# EAGLE design thinManV2 (EAGLE 6.6.0)

## Sheet 1 of 4
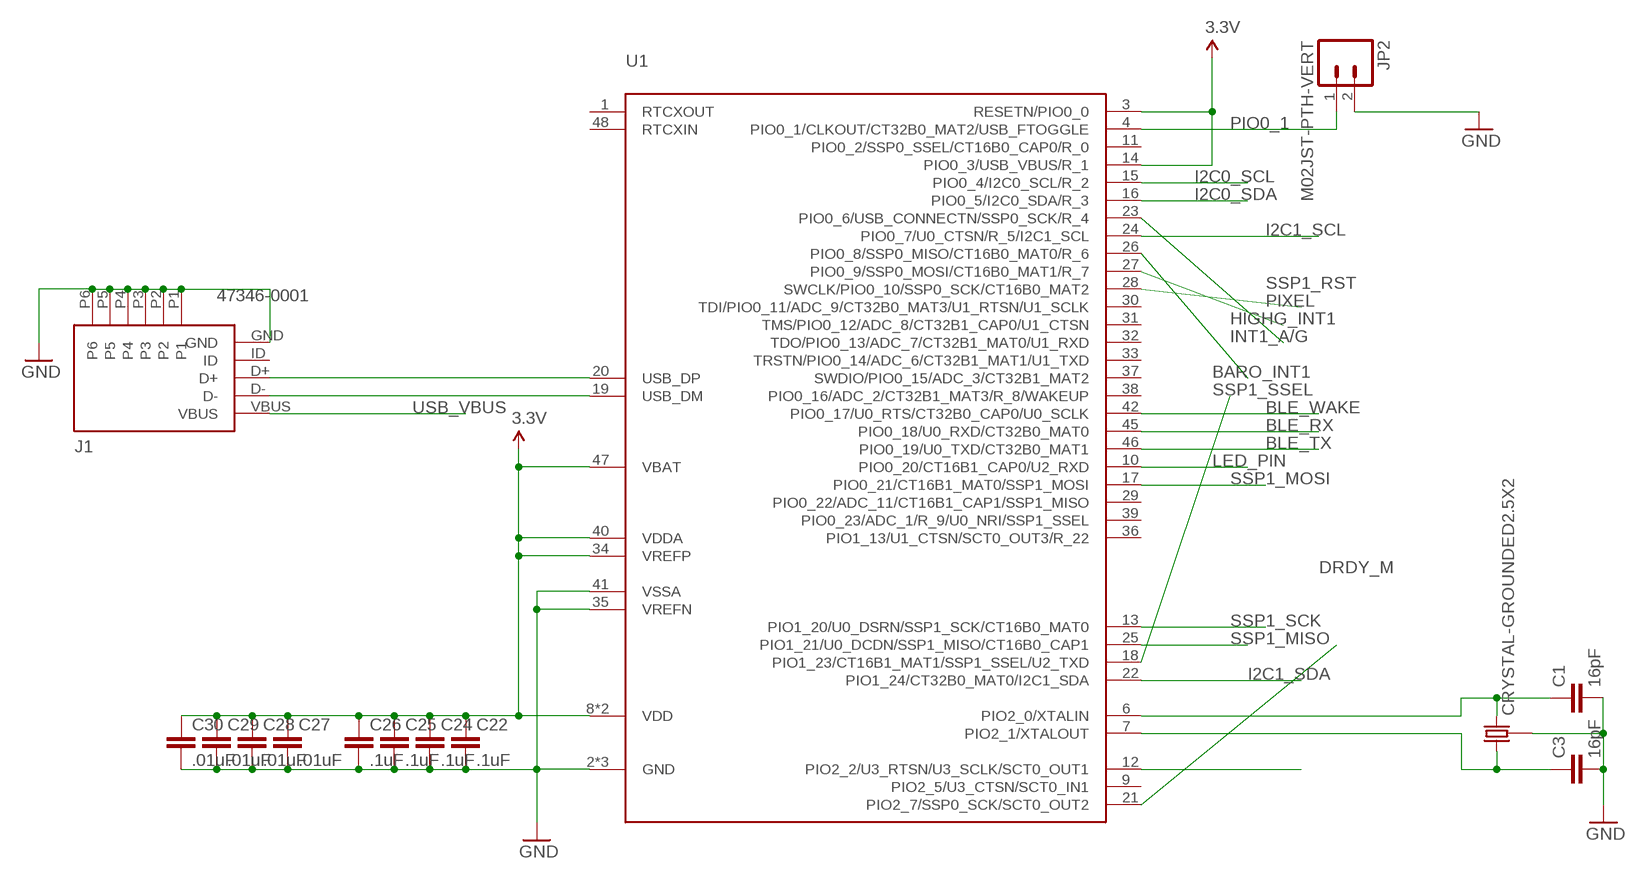
[diagram p0: schematic, sheet 1]

### Parts
C1  16pF  C0603  [C0603]
C3  16pF  C0603  [C0603]
C22  .1uF  C0603  [C0603]
C24  .1uF  C0603  [C0603]
C25  .1uF  C0603  [C0603]
C26  .1uF  C0603  [C0603]
C27  .01uF  C0603  [C0603]
C28  .01uF  C0603  [C0603]
C29  .01uF  C0603  [C0603]
C30  .01uF  C0603  [C0603]
J1  47346-0001  MICRO-USB  [MICRO_USB]
JP2  M02JST-PTH-VERT  [JST-2-PTH-VERT]
U1  LPC11U68JBD48  [LQFP48]
U$5  CRYSTAL-GROUNDED2.5X2  [CRYSTAL-SMD-2.5X2]

### Nets
3.3V: C22.1 C24.1 C25.1 C26.1 C27.1 C28.1 C29.1 C30.1 U1.3(RESETN/PIO0_0) U1.8(VDD) U1.14(PIO0_3/USB_VBUS/R_1) U1.34(VREFP) U1.40(VDDA) U1.44(VDD) U1.47(VBAT) ; also sheet 2,3,4
BARO_INT1: U1.26(PIO0_8/SSP0_MISO/CT16B0_MAT0/R_6) ; also sheet 2
BLE_RX: U1.45(PIO0_18/U0_RXD/CT32B0_MAT0) ; also sheet 3
BLE_TX: U1.46(PIO0_19/U0_TXD/CT32B0_MAT1) ; also sheet 3
BLE_WAKE: U1.42(PIO0_17/U0_RTS/CT32B0_CAP0/U0_SCLK) ; also sheet 3
DRDY_M: U1.21(PIO2_7/SSP0_SCK/SCT0_OUT2) ; also sheet 2
GND: C1.2 C3.2 C22.2 C24.2 C25.2 C26.2 C27.2 C28.2 C29.2 C30.2 J1.GND J1.P1 J1.P2 J1.P3 J1.P4 J1.P5 J1.P6 JP2.2 U1.2(GND) U1.5(GND) U1.35(VREFN) U1.41(VSSA) U1.43(GND) U$5.GND1 U$5.GND2 ; also sheet 2,3,4
HIGHG_INT1: U1.27(PIO0_9/SSP0_MOSI/CT16B0_MAT1/R_7) ; also sheet 2
I2C0_SCL: U1.15(PIO0_4/I2C0_SCL/R_2) ; also sheet 2
I2C0_SDA: U1.16(PIO0_5/I2C0_SDA/R_3) ; also sheet 2
I2C1_SCL: U1.24(PIO0_7/U0_CTSN/R_5/I2C1_SCL) ; also sheet 2,3
I2C1_SDA: U1.22(PIO1_24/CT32B0_MAT0/I2C1_SDA) ; also sheet 2,3
INT1_A/G: U1.23(PIO0_6/USB_CONNECTN/SSP0_SCK/R_4) ; also sheet 2
LED_PIN: U1.10(PIO0_20/CT16B1_CAP0/U2_RXD) ; also sheet 3
N$2: C3.1 U1.7(PIO2_1/XTALOUT) U$5.P1
N$3: C1.1 U1.6(PIO2_0/XTALIN) U$5.P2
N$15: J1.D+ U1.20(USB_DP)
N$17: J1.D- U1.19(USB_DM)
PIO0_1: JP2.1 U1.4(PIO0_1/CLKOUT/CT32B0_MAT2/USB_FTOGGLE)
PIXEL: U1.28(SWCLK/PIO0_10/SSP0_SCK/CT16B0_MAT2) ; also sheet 3
SSP1_MISO: U1.25(PIO1_21/U0_DCDN/SSP1_MISO/CT16B0_CAP1) ; also sheet 3
SSP1_MOSI: U1.17(PIO0_21/CT16B1_MAT0/SSP1_MOSI) ; also sheet 3
SSP1_RST: U1.12(PIO2_2/U3_RTSN/U3_SCLK/SCT0_OUT1) ; also sheet 3
SSP1_SCK: U1.13(PIO1_20/U0_DSRN/SSP1_SCK/CT16B0_MAT0) ; also sheet 3
SSP1_SSEL: U1.18(PIO1_23/CT16B1_MAT1/SSP1_SSEL/U2_TXD) ; also sheet 3
USB_VBUS: J1.VBUS ; also sheet 4
Unconnected: J1.ID U1.1(RTCXOUT) U1.9(PIO2_5/U3_CTSN/SCT0_IN1) U1.11(PIO0_2/SSP0_SSEL/CT16B0_CAP0/R_0) U1.29(PIO0_22/ADC_11/CT16B1_CAP1/SSP1_MISO) U1.30(TDI/PIO0_11/ADC_9/CT32B0_MAT3/U1_RTSN/U1_SCLK) U1.31(TMS/PIO0_12/ADC_8/CT32B1_CAP0/U1_CTSN) U1.32(TDO/PIO0_13/ADC_7/CT32B1_MAT0/U1_RXD) U1.33(TRSTN/PIO0_14/ADC_6/CT32B1_MAT1/U1_TXD) U1.36(PIO1_13/U1_CTSN/SCT0_OUT3/R_22) U1.37(SWDIO/PIO0_15/ADC_3/CT32B1_MAT2) U1.38(PIO0_16/ADC_2/CT32B1_MAT3/R_8/WAKEUP) U1.39(PIO0_23/ADC_1/R_9/U0_NRI/SSP1_SSEL) U1.48(RTCXIN)

## Sheet 2 of 4
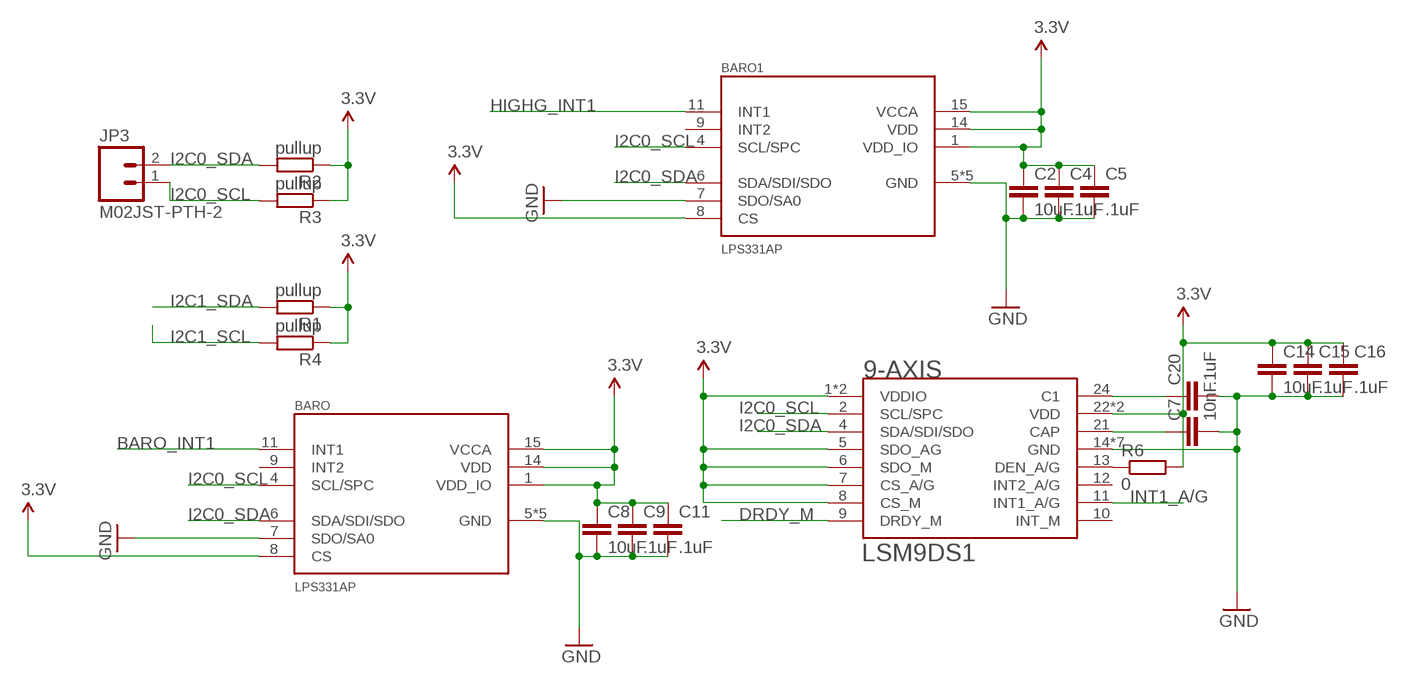
[diagram p1: schematic, sheet 2]

### Parts
9-AXIS  LSM9DS1  [LGA-24L-3.5X3X1]
BARO  LPS331AP  [LGA-16-3X3X1]
BARO1  LPS331AP  [LGA-16-3X3X1]
C2  10uF  C0603  [C0603]
C4  .1uF  C0603  [C0603]
C5  .1uF  C0603  [C0603]
C7  10nF  C0603  [C0603]
C8  10uF  C0603  [C0603]
C9  .1uF  C0603  [C0603]
C11  .1uF  C0603  [C0603]
C14  10uF  C0603  [C0603]
C15  .1uF  C0603  [C0603]
C16  .1uF  C0603  [C0603]
C20  .1uF  C0603  [C0603]
JP3  M02JST-PTH-2  [JST-2-PTH]
R1  pullup  R0805  [R0805]
R2  pullup  R0603  [R0603]
R3  pullup  R0603  [R0603]
R4  pullup  R0805  [R0805]
R6  0  R0603  [R0603]

### Nets
3.3V: 9-AXIS.1(VDDIO) 9-AXIS.3(VDDIO) 9-AXIS.5(SDO_AG) 9-AXIS.6(SDO_M) 9-AXIS.7(CS_A/G) 9-AXIS.8(CS_M) 9-AXIS.22(VDD) 9-AXIS.23(VDD) BARO1.1(VDD_IO) BARO1.8(CS) BARO1.14(VDD) BARO1.15(VCCA) BARO.1(VDD_IO) BARO.8(CS) BARO.14(VDD) BARO.15(VCCA) C2.1 C4.1 C5.1 C8.1 C9.1 C11.1 C14.1 C15.1 C16.1 R1.1 R2.1 R3.1 R4.1 R6.2 ; also sheet 1,3,4
BARO_INT1: BARO.11(INT1) ; also sheet 1
DRDY_M: 9-AXIS.9(DRDY_M) ; also sheet 1
GND: 9-AXIS.14(GND) 9-AXIS.15(GND) 9-AXIS.16(GND) 9-AXIS.17(GND) 9-AXIS.18(GND) 9-AXIS.19(GND) 9-AXIS.20(GND) BARO1.5(GND) BARO1.7(SDO/SA0) BARO1.10(GND) BARO1.12(GND) BARO1.13(GND) BARO1.16(GND) BARO.5(GND) BARO.7(SDO/SA0) BARO.10(GND) BARO.12(GND) BARO.13(GND) BARO.16(GND) C2.2 C4.2 C5.2 C7.2 C8.2 C9.2 C11.2 C14.2 C15.2 C16.2 C20.2 ; also sheet 1,3,4
HIGHG_INT1: BARO1.11(INT1) ; also sheet 1
I2C0_SCL: 9-AXIS.2(SCL/SPC) BARO1.4(SCL/SPC) BARO.4(SCL/SPC) JP3.1 R3.2 ; also sheet 1
I2C0_SDA: 9-AXIS.4(SDA/SDI/SDO) BARO1.6(SDA/SDI/SDO) BARO.6(SDA/SDI/SDO) JP3.2 R2.2 ; also sheet 1
I2C1_SCL: R4.2 ; also sheet 1,3
I2C1_SDA: R1.2 ; also sheet 1,3
INT1_A/G: 9-AXIS.11(INT1_A/G) ; also sheet 1
N$1: 9-AXIS.13(DEN_A/G) R6.1
N$11: 9-AXIS.21(CAP) C7.1
N$14: 9-AXIS.24(C1) C20.1
Unconnected: 9-AXIS.10(INT_M) 9-AXIS.12(INT2_A/G) BARO1.9(INT2) BARO.9(INT2)

## Sheet 3 of 4
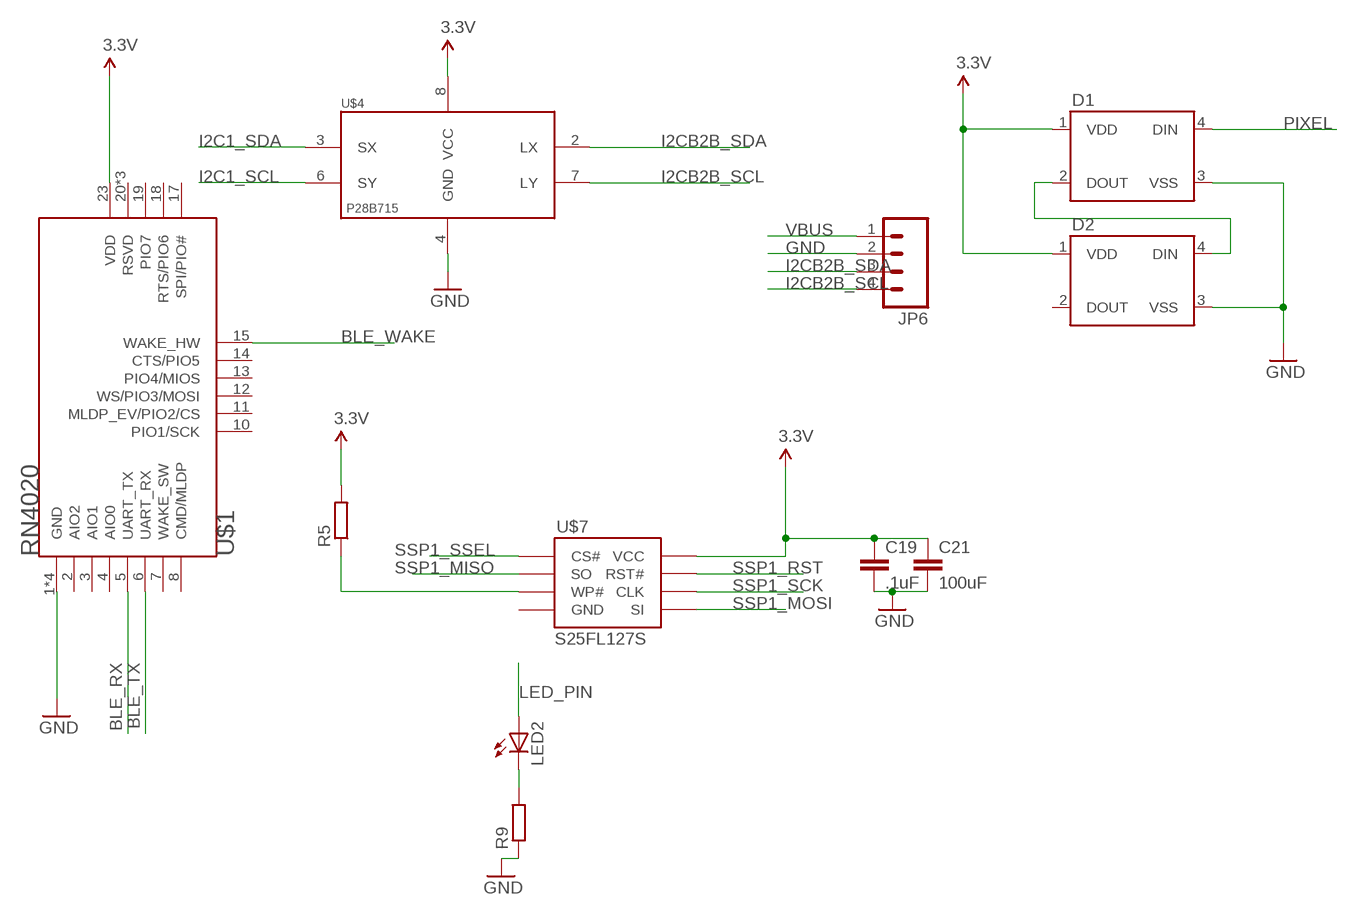
[diagram p2: schematic, sheet 3]

### Parts
C19  .1uF  C0603  [C0603]
C21  100uF  C0603  [C0603]
D1  WS2812B  [WS2812B]
D2  WS2812B  [WS2812B]
JP6  M04JST  [1X04-1.5MM_JST]
LED2  LEDCHIPLED_0603  [CHIPLED_0603]
R5  R0603  [R0603]
R9  R0603  [R0603]
U$1  RN4020  [RN4020]
U$4  P82B715  [SO8]
U$7  S25FL127S  [SO08]

### Nets
3.3V: C19.1 C21.1 D1.1(VDD) D2.1(VDD) R5.2 U$1.23(VDD) U$4.8(VCC) U$7.8(VCC) ; also sheet 1,2,4
BLE_RX: U$1.5(UART_TX) ; also sheet 1
BLE_TX: U$1.6(UART_RX) ; also sheet 1
BLE_WAKE: U$1.15(WAKE_HW) ; also sheet 1
GND: C19.2 C21.2 D1.3(VSS) D2.3(VSS) JP6.2 R9.1 U$1.1(GND) U$1.9(GND) U$1.16(GND) U$1.24(GND) U$4.4(GND) ; also sheet 1,2,4
I2C1_SCL: U$4.6(SY) ; also sheet 1,2
I2C1_SDA: U$4.3(SX) ; also sheet 1,2
I2CB2B_SCL: JP6.4 U$4.7(LY)
I2CB2B_SDA: JP6.3 U$4.2(LX)
LED_PIN: LED2.A ; also sheet 1
N$4: R5.1 U$7.3(WP#)
N$5: LED2.C R9.2
N$6: D1.2(DOUT) D2.4(DIN)
PIXEL: D1.4(DIN) ; also sheet 1
SSP1_MISO: U$7.2(SO) ; also sheet 1
SSP1_MOSI: U$7.5(SI) ; also sheet 1
SSP1_RST: U$7.7(RST#) ; also sheet 1
SSP1_SCK: U$7.6(CLK) ; also sheet 1
SSP1_SSEL: U$7.1(CS#) ; also sheet 1
VBUS: JP6.1 ; also sheet 4
Unconnected: D2.2(DOUT) U$1.2(AIO2) U$1.3(AIO1) U$1.4(AIO0) U$1.7(WAKE_SW) U$1.8(CMD/MLDP) U$1.10(PIO1/SCK) U$1.11(MLDP_EV/PIO2/CS) U$1.12(WS/PIO3/MOSI) U$1.13(PIO4/MIOS) U$1.14(CTS/PIO5) U$1.17(SPI/PIO#) U$1.18(RTS/PIO6) U$1.19(PIO7) U$1.20(RSVD) U$1.21(RSVD) U$1.22(RSVD) U$7.4(GND)

## Sheet 4 of 4: Power
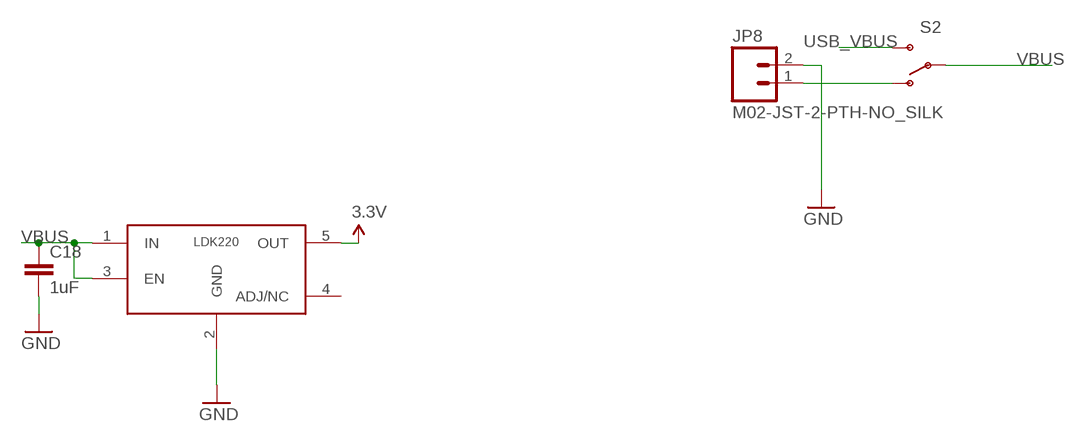
[diagram p3: schematic, sheet 4]

### Parts
C18  1uF  C0603  [C0603]
JP8  M02-JST-2-PTH-NO_SILK  [JST-2-PTH-NS]
S2  SWITCH-SPDT-SMD-A  [SWITCH-SPST-SMD-A]
U$6  LDK220M33R  [SOT23-5]

### Nets
3.3V: U$6.5(OUT) ; also sheet 1,2,3
GND: C18.2 JP8.2 U$6.2(GND) ; also sheet 1,2,3
N$20: JP8.1 S2.1(O)
USB_VBUS: S2.3(S) ; also sheet 1
VBUS: C18.1 S2.2(P) U$6.1(IN) U$6.3(EN) ; also sheet 3
Unconnected: U$6.4(ADJ/NC)

## Library data of the parts
9-AXIS = Sensors:LSM9DS1; OC_NEWARK: unknown
BARO BARO1 = Sensors:LPS331AP; MPN: LPS331APTR; OC_NEWARK: 52X6707
C1 C3 = ELL-i-Passives:C: Surface Mount Capasitors — in standard sizes A capacitor used to store energy electrostatically in an electric field. If you need a high-value capacitor, consider using a polarised capacitor to save space. Wikipedia article on capacitors <https://en.wikipedia.org/wiki/Capacitor>; OC_NEWARK: unknown
C2 C4 C5 C8 C9 C11 C14-C16 C18 C19 C21 C22 C24-C30 = ELL-i-Passives:C: Surface Mount Capasitors — in standard sizes A capacitor used to store energy electrostatically in an electric field. If you need a high-value capacitor, consider using a polarised capacitor to save space. Wikipedia article on capacitors <https://en.wikipedia.org/wiki/Capacitor>
C7 C20 = ELL-i-Passives:C: Surface Mount Capasitors — in standard sizes A capacitor used to store energy electrostatically in an electric field. If you need a high-value capacitor, consider using a polarised capacitor to save space. Wikipedia article on capacitors <https://en.wikipedia.org/wiki/Capacitor>; MPN: S103M47Z5UN63L0R; OC_NEWARK: 83K9283
D1 D2 = SparkFun-LED:WS2812B: WS2812B - Intelligent control LED integrated light source Technical Specifications: Power Supply Voltage (VDD): 3.5 to 5.3 V Input Voltage (VI): -0.5 to VDD+0.5 V Operating Junction Temperature (Topt): -25°C to +80°C Storage Temperature Range (Tstg): -55°C to +150°C
J1 = ELL-i-Connectors:MICRO-USB: Micro USB from Molex CONN RCPT 5POS MICRO USB R/A Datasheet <http://www.molex.com/pdm_docs/sd/473460001_sd.pdf>; PARTNO: AS-ITM-00021
JP2 = SparkFun-Connectors:M02: Standard 2-pin 0.1" header. Use with - straight break away headers ( PRT-00116) - right angle break away headers (PRT-00553) - swiss pins (PRT-00743) - machine pins (PRT-00117) - female headers (PRT-00115) Molex polarized connector foot print use with: PRT-08233 with associated crimp pins and housings. 2.54_SCREWTERM for use with PRT-10571. 3.5mm Screw Terminal footprints for PRT-08084 5mm Screw Terminal footprints for use with PRT-08432
JP3 = SparkFun-Connectors:M02: Standard 2-pin 0.1" header. Use with - straight break away headers ( PRT-00116) - right angle break away headers (PRT-00553) - swiss pins (PRT-00743) - machine pins (PRT-00117) - female headers (PRT-00115) Molex polarized connector foot print use with: PRT-08233 with associated crimp pins and housings. 2.54_SCREWTERM for use with PRT-10571. 3.5mm Screw Terminal footprints for PRT-08084 5mm Screw Terminal footprints for use with PRT-08432; OC_NEWARK: unknown; SKU: PRT-09914
JP6 = SparkFun-Connectors:M04: Header 4 Standard 4-pin 0.1" header. Use with straight break away headers (SKU : PRT-00116), right angle break away headers (PRT-00553), swiss pins (PRT-00743), machine pins (PRT-00117), and female headers (PRT-00115). Molex polarized connector foot print use with SKU : PRT-08231 with associated crimp pins and housings. 1MM SMD Version SKU: PRT-10208; OC_NEWARK: unknown
JP8 = SparkFun-Connectors:M02: Standard 2-pin 0.1" header. Use with - straight break away headers ( PRT-00116) - right angle break away headers (PRT-00553) - swiss pins (PRT-00743) - machine pins (PRT-00117) - female headers (PRT-00115) Molex polarized connector foot print use with: PRT-08233 with associated crimp pins and housings. 2.54_SCREWTERM for use with PRT-10571. 3.5mm Screw Terminal footprints for PRT-08084 5mm Screw Terminal footprints for use with PRT-08432; OC_NEWARK: unknown
LED2 = adafruit:LED: LED OSRAM: - CHIPLED LG R971, LG N971, LY N971, LG Q971, LY Q971, LO R971, LY R971 LH N974, LH R974 LS Q976, LO Q976, LY Q976 LO Q996 - Hyper CHIPLED LW Q18S LB Q993, LB Q99A, LB R99A - SideLED LS A670, LO A670, LY A670, LG A670, LP A670 LB A673, LV A673, LT A673, LW A673 LH A674 LY A675 LS A676, LA A676, LO A676, LY A676, LW A676 LS A679, LY A679, LG A679 - Hyper Micro SIDELED® LS Y876, LA Y876, LO Y876, LY Y876 LT Y87S - SmartLED LW L88C, LW L88S LB L89C, LB L89S, LG L890 LS L89K, LO L89K, LY L89K LS L896, LA L896, LO L896, LY L896 - TOPLED LS T670, LO T670, LY T670, LG T670, LP T670 LSG T670, LSP T670, LSY T670, LOP T670, LYG T670 LG T671, LOG T671, LSG T671 LB T673, LV T673, LT T673, LW T673 LH T674 LS T676, LA T676, LO T676, LY T676, LB T676, LH T676, LSB T676, LW T676 LB T67C, LV T67C, LT T67C, LS T67K, LO T67K, LY T67K, LW E67C LS E67B, LA E67B, LO E67B, LY E67B, LB E67C, LV E67C, LT E67C LW T67C LS T679, LY T679, LG T679 LS T770, LO T770, LY T770, LG T770, LP T770 LB T773, LV T773, LT T773, LW T773 LH T774 LS E675, LA E675, LY E675, LS T675 LS T776, LA T776, LO T776, LY T776, LB T776 LHGB T686 LT T68C, LB T68C - Hyper Mini TOPLED® LB M676 - Mini TOPLED Santana® LG M470 LS M47K, LO M47K, LY M47K Source: http://www.osram.convergy.de/; OC_NEWARK: unknown
R1-R4 R9 = ELL-i-Passives:R: Surface Mount Resistor — in standard sizes; OC_NEWARK: unknown
R5 R6 = ELL-i-Passives:R: Surface Mount Resistor — in standard sizes
S2 = SparkFun-Electromechanical:SWITCH-SPDT: SPDT Switch Simple slide switch, Spark Fun Electronics SKU : COM-00102 DPDT SMT slide switch, AYZ0202, SWCH-08179
U1 = LPC11U68:LPC11U68JBD48; OC_NEWARK: unknown
U$1 = bluetooth:RN4020: RN4020 Bluetooth Low Energy RF module
U$4 = Sensors:P82B715; OC_NEWARK: unknown
U$5 = SparkFun-FreqCtrl:CRYSTAL-GROUNDED; OC_NEWARK: unknown
U$6 = Sensors:LDK220M33R; OC_NEWARK: unknown
U$7 = SparkFun-DigitalIC:S25FL127S

## Board
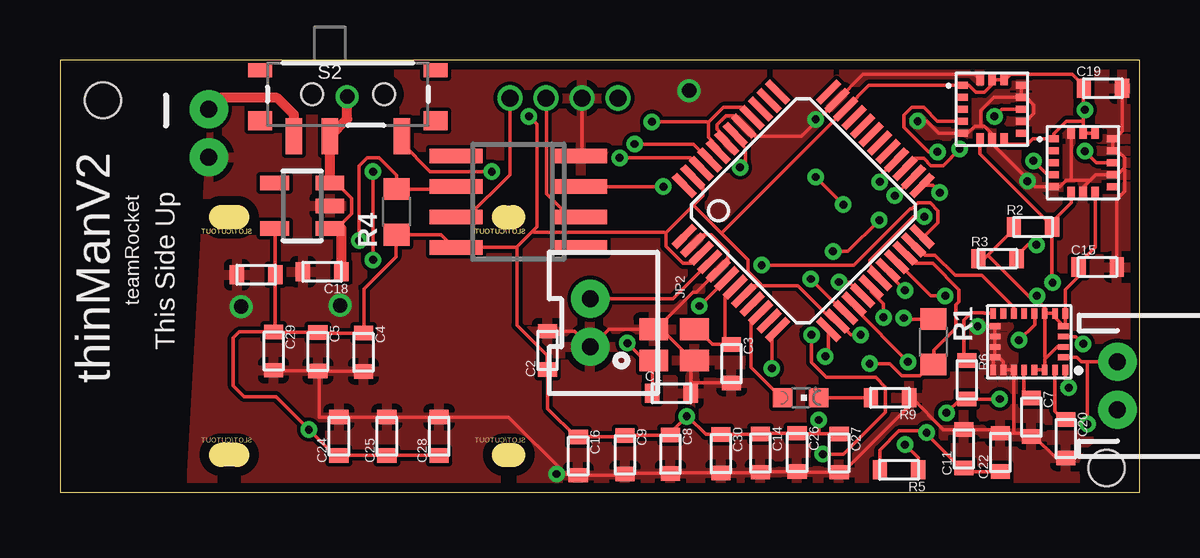
[diagram p4: board, top side]
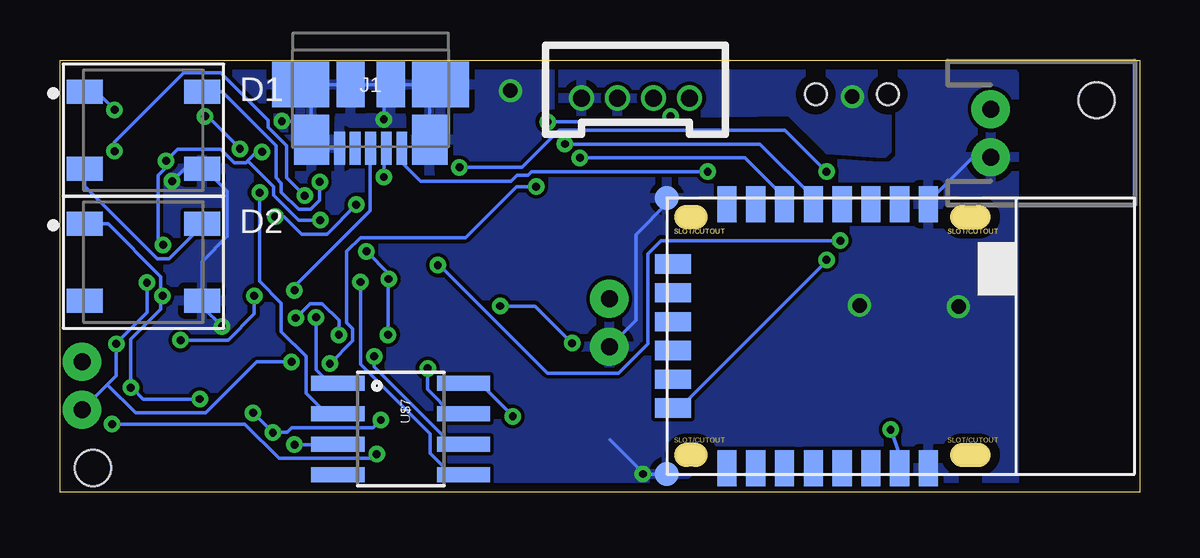
[diagram p5: board, bottom side, seen from below]

Size 45 x 18 mm. Coordinates in mm from the lower left corner, seen from the top.
Outline: 0,0 45,0 45,18 0,18 0,0
Copper layers (1*16): Top 0.0356mm / dielectric 1.5011mm / Bottom 0.0356mm
Design rules "LaenPCBOrder *": minimum track width 6mil, minimum drill 13mil, track to track 6mil, track to pad 6mil, pad to pad 6mil, via to via 6mil, smd to smd 6mil, copper to edge 15mil, drill to drill 6mil, minimum pad ring 7mil, minimum via ring 7mil, stop-mask expansion 3mil, vias tented up to drill 0mil, thermal gap 10mil
Holes 1.5 mm at 43.62,1 1.8,16.32

### Footprints (pad centres in the part's own frame; a part is rotated, then mirrored left to right if it is on the bottom)
LGA-24L-3.5X3X1 = smd 0.24 x 0.45: 1 0.245,2.675; 6 0.245,0.325; 7 0.675,0.325; 8 1.105,0.325; 9 1.535,0.325; 10 1.965,0.325; 11 2.395,0.325; 12 2.825,0.325; 13 3.255,0.325; 18 3.255,2.675; 19 2.825,2.675; 20 2.395,2.675; 21 1.965,2.675; 22 1.535,2.675; 23 1.105,2.675; 24 0.675,2.675 | smd 0.45 x 0.24: 2 0.325,2.145; 3 0.325,1.715; 4 0.325,1.285; 5 0.325,0.855; 14 3.175,0.855; 15 3.175,1.285; 16 3.175,1.715; 17 3.175,2.145
LGA-16-3X3X1 = smd 0.45 x 0.3: 1 0.275,2.5; 2 0.275,2; 3 0.275,1.5; 4 0.275,1; 5 0.275,0.5; 9 2.725,0.5; 10 2.725,1; 11 2.725,1.5; 12 2.725,2; 13 2.725,2.5 | smd 0.3 x 0.45: 6 1,0.275; 7 1.5,0.275; 8 2,0.275; 14 2,2.725; 15 1.5,2.725; 16 1,2.725
C0603 = smd 0.6 x 0.8: 1 -0.8,0; 2 0.8,0
WS2812B = smd 1.5 x 1: 1 -2.45,1.6; 2 -2.45,-1.6; 3 2.45,-1.6; 4 2.45,1.6
MICRO_USB = smd 1.38 x 0.45: D+ 2.66,0; D- 2.66,0.65; GND 2.66,-1.3; ID 2.66,-0.65; VBUS 2.66,1.3 | smd 2.1 x 1.475: P1 2.3,-2.462; P2 2.3,2.462 | smd 1.9 x 2.375: P3 0,2.913; P4 0,-2.913 | smd 1.9 x 1.175: P5 0,0.838; P6 0,-0.838
JST-2-PTH-VERT = drill 0.7 pad 1.6: 1 -1,-0.55; 2 1,-0.55
JST-2-PTH = drill 0.7 pad 1.6: 1 -1,0; 2 1,0
1X04-1.5MM_JST = drill 0.7: 1 0,0; 2 1.5,0; 3 3,0; 4 4.5,0
JST-2-PTH-NS = drill 0.7 pad 1.6: 1 -1,0; 2 1,0
CHIPLED_0603 = smd 0.8 x 0.8: A 0,-0.75; C 0,0.75
R0805 = smd 0.9 x 1.1: 1 -0.95,0; 2 0.95,0
R0603 = smd 0.6 x 0.8: 1 -0.8,0; 2 0.8,0
SWITCH-SPST-SMD-A = smd 0.7 x 1.5: 1 -2.25,-1.75; 2 -0.75,-1.75; 3 2.25,-1.75 | smd 1 x 0.6: GND1 -3.65,1; GND3 3.65,1 | smd 1 x 0.8: GND2 -3.65,-1.1; GND4 3.65,-1.1 | hole 0.9: -1.5,0; 1.5,0
LQFP48 = smd 0.3 x 1.2: 1 -2.75,-4.25; 2 -2.25,-4.25; 3 -1.75,-4.25; 4 -1.25,-4.25; 5 -0.75,-4.25; 6 -0.25,-4.25; 7 0.25,-4.25; 8 0.75,-4.25; 9 1.25,-4.25; 10 1.75,-4.25; 11 2.25,-4.25; 12 2.75,-4.25; 25 2.75,4.25; 26 2.25,4.25; 27 1.75,4.25; 28 1.25,4.25; 29 0.75,4.25; 30 0.25,4.25; 31 -0.25,4.25; 32 -0.75,4.25; 33 -1.25,4.25; 34 -1.75,4.25; 35 -2.25,4.25; 36 -2.75,4.25 | smd 1.2 x 0.3: 13 4.25,-2.75; 14 4.25,-2.25; 15 4.25,-1.75; 16 4.25,-1.25; 17 4.25,-0.75; 18 4.25,-0.25; 19 4.25,0.25; 20 4.25,0.75; 21 4.25,1.25; 22 4.25,1.75; 23 4.25,2.25; 24 4.25,2.75; 37 -4.25,2.75; 38 -4.25,2.25; 39 -4.25,1.75; 40 -4.25,1.25; 41 -4.25,0.75; 42 -4.25,0.25; 43 -4.25,-0.25; 44 -4.25,-0.75; 45 -4.25,-1.25; 46 -4.25,-1.75; 47 -4.25,-2.25; 48 -4.25,-2.75
RN4020 = smd 1.5 x 0.8: 1 0.25,10.9; 2 0.25,9.7; 3 0.25,8.5; 4 0.25,7.3; 5 0.25,6.1; 6 0.25,4.9; 7 0.25,3.7; 8 0.25,2.5; 17 11.25,2.5; 18 11.25,3.7; 19 11.25,4.9; 20 11.25,6.1; 21 11.25,7.3; 22 11.25,8.5; 23 11.25,9.7; 24 11.25,10.9 | smd 1 x 1: 9 0,0; 16 11.5,0 | smd 0.8 x 1.5: 10 2.75,0.25; 11 3.95,0.25; 12 5.15,0.25; 13 6.35,0.25; 14 7.55,0.25; 15 8.75,0.25
SO8 = smd 0.6 x 2.2: 1 -1.905,-2.6; 2 -0.635,-2.6; 3 0.635,-2.6; 4 1.905,-2.6; 5 1.905,2.6; 6 0.635,2.6; 7 -0.635,2.6; 8 -1.905,2.6
CRYSTAL-SMD-2.5X2 = smd 1.2 x 0.9: GND1 0.6,1.8; GND2 2.3,0.5; P1 2.3,1.8; P2 0.6,0.5
SOT23-5 = smd 0.6 x 1.2: 1 -0.95,-1.15; 2 0,-1.15; 3 0.95,-1.15; 4 0.95,1.15; 5 -0.95,1.15
SO08 = smd 0.61 x 2.21: 1 -1.905,-2.616; 2 -0.635,-2.616; 3 0.635,-2.616; 4 1.905,-2.616; 5 1.905,2.616; 6 0.635,2.616; 7 -0.635,2.616; 8 -1.905,2.616

### Placement (x,y rotation side)
9-AXIS  42.15,7.76 180 top
BARO  41.15,12.22 0 top
BARO1  37.35,14.45 0 top
C1  25.49,4.12 0 top
C2  20.32,5.9 90 top
C3  28,5.35 270 top
C4  12.65,5.83 270 top
C5  10.75,5.85 270 top
C7  40.49,3.12 270 top
C8  25.45,1.57 270 top
C9  23.55,1.55 270 top
C11  37.67,1.8 90 top
C14  29.2,1.62 270 top
C15  43.25,9.38 0 top
C16  21.6,1.5 270 top
C18  10.93,9.18 180 top
C19  43.48,16.82 0 top
C20  41.92,2.23 270 top
C21  8.18,9.05 180 top
C22  39.2,1.65 90 top
C24  11.62,2.33 90 top
C25  13.62,2.33 90 top
C26  30.73,1.65 270 top
C27  32.48,1.62 270 top
C28  15.8,2.33 90 top
C29  8.9,5.88 270 top
C30  27.55,1.6 270 top
D1  41.52,15.07 0 bottom
D2  41.52,9.57 0 bottom
J1  32.05,16.98 270 bottom
JP2  22.65,7.05 270 top
JP3  44.08,4.42 270 top
JP6  23.26,16.41 0 bottom
JP8  6.2,14.95 270 bottom
LED2  30.88,3.92 270 top
R1  36.41,6.25 270 top
R2  40.56,11.04 0 top
R3  39.08,9.72 0 top
R4  14.03,11.67 90 top
R5  34.98,0.93 180 top
R6  37.8,4.67 270 top
R9  34.6,3.93 180 top
S2  12,16.57 0 top
U1  30.98,11.71 315 top
U$1  19.7,12.25 270 bottom
U$4  19.11,12.1 90 top
U$5  24.15,4.98 0 top
U$6  10.1,11.93 90 top
U$7  30.8,2.62 270 bottom

### Tracks (layer width: path | path; a pad name or v marks a point on that pad's centre or on a via)
3.3V  (via drill 0.33)
  Top 0.152: BARO1.8 39.35,14.62 39.48,14.5 40.33,14.5 40.55,14.72 41.4,14.72 BARO.1 41.42,14.8 41.42,14.93 41.95,15.45 42.65,15.45 | BARO.14 43.12,14.95 BARO.15 42.65,15.03 42.65,15.45 | 42.65,15.93 42.65,16.77 42.67,16.8 C19.1 42.7,16.9 42.2,17.4 39.62,17.4 39.42,17.2 BARO1.14 BARO1.15 38.85,16.98 38.52,16.65 38.17,16.65 37.88,16.95 BARO1.1 33.73,16.95 32.75,15.97 U1.34 32.7,15.9 27.57,10.78 | 42.65,15.93 42.65,15.45 | v42.73,15.93 42.65,15.93 | 25.25,10.8 25.25,10.25 25.98,9.53 26.32,9.53 26.73,9.93 U1.3 | 26.4,11.95 26.8,12.35 26.8,12.75 26.4,13.15 U1.47 | 26.4,11.95 25.25,10.8 | v35.17,7.25 35.23,7.2 R1.1 | v33.38,6.55 32.98,6.55 U1.14 32.35,7.17 32.17,7.17 30.75,8.6 29.2,8.6 | 29.2,8.6 28.93,8.6 28.52,8.2 U1.8 | 27.57,10.78 28.68,9.68 28.68,9.2 29.2,8.68 29.2,8.6 | 27.57,10.78 26.4,11.95 | R3.1 38.52,9.72 38.67,9.88 | 38.67,9.88 39.75,10.95 39.75,11.03 R2.1 | 9-AXIS.8 41.05,7.45 41.4,7.45 9-AXIS.7 41.48,7.28 41.83,6.92 9-AXIS.5 41.9,6.95 9-AXIS.6 41.9,7.5 41.9,8.43 42.45,8.97 C15.1 42.45,9.5 43.15,10.2 43.15,12.47 BARO.8 | 9-AXIS.22 40.62,5.1 41.02,5.1 9-AXIS.23 41.05,5.17 41.05,5.53 41.1,5.58 | 41.1,5.58 41.58,6.05 9-AXIS.3 | 9-AXIS.8 41.05,7.38 41.05,5.62 41.1,5.58 | 38.67,9.88 40.6,7.95 40.73,7.95 | 40.73,7.95 40.77,7.95 41.05,7.67 41.05,7.53 9-AXIS.8 | R5.2 34.17,1.75 34.98,2.55 36,2.55 36.1,2.45 | 36.1,2.45 37.55,1 C11.1 37.8,1 37.95,0.85 C22.1 | v42.05,4.35 41.9,4.5 9-AXIS.1 | v39.17,3.88 R6.2 37.52,3.88 v36.95,3.3 | v36.12,2.48 36.1,2.45 | v40.73,8.18 40.73,7.95 | C28.1 C25.1 C24.1 11.45,1.52 v10.38,2.6 9,3.98 7.67,3.98 7.22,4.42 7.22,6.42 7.47,6.67 C29.1 | U$6.5 8.97,10.97 C21.1 8.97,6.72 C29.1
  Top 0.152: C5.1 8.95,6.65 8.93,6.67 C29.1 | C5.1 10.82,6.62 C4.1 12.68,6.7 12.68,8.47 14,9.8 14,10.65 R4.1 14.05,10.72 15.88,10.72 16.4,10.2 U$4.8 16.57,10.2 19.02,10.2 | 10.72,6.58 C5.1 | 31.62,2.42 30.8,2.42 C26.1 29.27,2.45 C14.1 29.18,2.42 29.15,2.4 C30.1 26.93,2.4 26.2,3.12 v26.12,3.15 25.43,2.45 C8.1 23.62,2.38 C9.1 23.43,2.35 23.38,2.3 C16.1 21.52,2.27 20.32,3.48 C2.1 20.3,5.17 20.3,5.7 19.05,6.95 19.05,10.12 19.02,10.2 | 31.62,2.42 C27.1 | 27.02,15.4 27.02,14.78 27.43,14.38 27.43,14.2 U1.44 | 27.02,15.4 27.65,16.02 28.43,16.02 U1.40 | v24.68,15.43 26.95,15.43 27.02,15.4 | v19.55,15.65 19.88,15.32 19.88,11.05 19.7,10.88 | 19.02,10.2 19.7,10.88 | 31.62,2.42 v31.62,3 | 25.25,10.8 25.18,10.82 19.75,10.82 19.7,10.88
  Bottom 0.152: D1.1 43.48,16.68 v42.73,15.93 | v35.17,7.25 34.58,7.85 34.08,7.85 33.38,7.15 v33.38,6.55 | 40.8,8.18 40.8,8.97 43,11.18 D2.1 | 40.8,8.18 40.8,7.62 42.05,6.38 v42.05,4.35 41.98,4.33 41.52,3.88 v39.17,3.88 | v36.95,3.3 v36.12,2.48 36.05,2.5 35.52,2.5 35.35,2.67 31.95,2.67 v31.62,3 | v40.73,8.18 40.8,8.18 | U$1.23 10,1.52 v10.38,2.6 | v26.12,3.15 27.5,4.53 U$7.8 | v24.68,15.43 19.77,15.43 v19.55,15.65
BARO_INT1  (via drill 0.33)
  Top 0.152: v42.73,14.2 43.2,13.72 43.85,13.72 BARO.11 | v34.8,12.35 U1.26
  Bottom 0.152: v42.73,14.2 42.73,14.6 39.85,17.48 38.3,17.48 36.33,15.5 36.33,15.2 35.55,14.43 35.55,13.1 v34.8,12.35
BLE_RX  (via drill 0.33)
  Top 0.152: v23.95,14.5 26.4,14.5 27.05,13.85 27.07,13.85 U1.45
  Bottom 0.152: v23.95,14.5 15.82,14.5 13.6,12.28 U$1.5
BLE_TX  (via drill 0.33)
  Top 0.152: v23.32,13.93 26.27,13.93 26.7,13.5 26.73,13.5 U1.46
  Bottom 0.152: v23.32,13.93 16.45,13.93 14.8,12.28 U$1.6
BLE_WAKE  (via drill 0.33)
  Top 0.152: v28.35,13.53 28.57,13.75 28.57,14.32 28.18,14.72 28.18,14.88 U1.42 | v13.05,9.68 v13.05,13.35
  Bottom 0.152: v28.35,13.53 25.75,13.53 24.2,15.07 14.78,15.07 v13.05,13.35 | v13.05,9.68 13.05,9.62 19.18,3.5 U$1.15
DRDY_M  (via drill 0.33)
  Top 0.152: v39.98,6.33 40.62,6.97 9-AXIS.9 | v36.9,8.18 36.3,8.18 U1.21
  Bottom 0.152: v39.98,6.33 38,6.33 36.9,7.42 v36.9,8.18
GND  (via drill 0.33, 0.6)
  Top 0.152: U1.43 27.77,14.55 27.77,14.72 27.38,15.12 27.38,15.3 27.75,15.68 28.07,15.68 U1.41 28.57,15.22 28.98,14.82 30.9,14.82 31.55,15.47 | BARO1.16 38.12,17.4 33.48,17.4 32.4,16.32 U1.35 32.35,16.27 31.55,15.47 | U$4.4 21.75,14 JP6.2 | v31.5,15.53 31.55,15.47 | U1.2 26.4,10.32 26.8,10.72 27.15,10.72 27.85,10.03 27.85,9.65 U1.5 27.4,9.2 26.52,8.32 26.38,8.32 24.9,6.85 U$5.GND1 | 26.3,4.55 26.3,5.42 26.35,5.47 U$5.GND2 26.32,5.53 25.07,6.78 U$5.GND1 | 26.3,4.55 C1.2 | 26.3,4.55 C3.2 | C2.2 21.45,6.7 JP2.2 | U$5.GND1 24.68,6.78 22.88,6.78 22.18,6.08 JP2.2 | 38.38,15.25 38.12,15.25 37.83,14.95 BARO1.5 36.62,14.95 36.12,15.45 v35.75,15.45 | 38.38,15.25 38.52,15.25 38.85,14.93 BARO1.7 38.85,14.53 40.38,13 | BARO1.10 40.27,15.45 40.6,15.78 40.6,16.12 40.27,16.45 BARO1.12 | BARO1.12 BARO1.13 | 38.38,15.25 38.38,15.9 38.92,16.45 BARO1.12 | 42.9,12.95 43.17,13.22 43.85,13.22 BARO.10 43.92,13.22 44.08,13.22 44.33,13.47 | 42.9,12.95 42.65,12.7 BARO.7 | 42.15,13 42.85,13 42.9,12.95 | 42.15,13 41.95,13 41.67,12.72 BARO.5 41.35,12.72 40.65,12.72 40.38,13 | 42.15,13 42.15,14.93 BARO.16 | 44.33,13.47 44.38,13.53 44.38,13.93 44.08,14.22 43.95,14.22 BARO.12 43.88,14.7 BARO.13 43.95,14.7 44.27,15.03 C19.2 | C15.2 44.05,12.2 44.38,12.53 44.38,13.43 44.33,13.47 | v40.33,12.95 40.38,13 | C5.2 8.95,5.05 8.93,5.08 C29.2 | C4.2 10.82,5.03 C5.2 | C5.2 10.8,4.95 10.8,3.12 C24.2 C25.2 C28.2 18.7,3.12 21,0.82 v20.7,0.75 21.55,0.75 C16.2 23.38,0.7 23.43,0.75 C9.2 23.62,0.78 C8.2 25.52,0.8 C30.2 29.15,0.8 29.18,0.82 C14.2 29.27,0.85 C26.2 30.8,0.82 C27.2 32.62,0.82 35.4,3.6 R9.1 35.5,3.92 36.83,2.6 C11.2 38.92,2.6 39.08,2.45 C22.2 39.75,2.45
  Top 0.152: 9-AXIS.18 38.9,5.1 38.9,5.6 38.92,5.62 9-AXIS.17 | 9-AXIS.17 9-AXIS.16 9-AXIS.15 9-AXIS.14 38.9,6.9 v38.25,6.9 | 9-AXIS.17 39.05,5.62 39.12,5.62 39.33,5.42 9-AXIS.19 39.4,5.1 39.75,5.1 9-AXIS.20 39.75,5.03 39.75,2.45 | 39.75,2.45 40.25,2.45 40.38,2.33 40.48,2.33 C7.2 40.55,2.33 40.6,2.33 41.5,1.43 C20.2 | 22.07,5.97 JP2.2
  Bottom 0.152: J1.P5 J1.P6 J1.P4 34.88,16.98 34.52,16.62 34.52,14.75 J1.P1 | J1.GND 34.27,14.32 34.52,14.57 34.52,14.68 J1.P1 | J1.P3 29.23,16.98 29.6,16.6 J1.P2 | 28.77,17.23 29.02,16.98 J1.P3 | J1.P3 J1.P5 | v31.5,15.53 31.5,16.9 J1.P5 | JP8.2 6.95,13.95 8.82,12.07 U$1.1 | U$1.9 19.7,12.03 21,10.72 21,7.15 JP2.2 | v40.33,12.95 39.8,13.47 D1.3 38.98,13.47 38.02,12.53 38.02,10.65 39.08,9.6 D2.3 39.05,7.9 39.05,7.7 v38.25,6.9 | U$1.16 v20.7,0.75 20.73,0.82 22.07,2.17 | v35.75,15.45 34.6,15.45 J1.P1
  other vias: 26.23,16.73 11.68,7.78 7.55,7.72
  pour Top: 6.55,18.9 45.5,18.9 45.5,-1 5.45,-1 5.45,-0.3
  pour Bottom (rank 3): 5.88,18 44.75,18 44.75,-0.12 5.22,-0.12 5.22,17.4
HIGHG_INT1  (via drill 0.33)
  Top 0.152: BARO1.11 39.25,15.95 v38.95,15.65 | v37.5,14.3 37.15,13.95 37.15,13.93 36.83,13.6 36.3,13.6 36,13.9 35.62,13.9 35.23,13.5 U1.27
  Bottom 0.152: v38.95,15.65 38.85,15.65 v37.5,14.3
I2C0_SCL  (via drill 0.33)
  Top 0.152: JP3.1 42.83,5.42 | 42.83,5.42 42.58,5.42 42.38,5.62 9-AXIS.2 | v40.58,13.8 41.15,13.22 41.4,13.22 BARO.4 | v40.7,10.3 40.35,10.3 39.88,9.82 R3.2 | BARO1.4 36.58,15.45 36,16.02 35.5,16.02 35.17,15.7 35.17,15.2 36.2,14.18 v36.58,14.18 | v31.3,8.88 32.7,7.47 32.73,7.47 U1.15 | v32.23,10.03 32.85,10.03 v34.15,11.32 | v42.83,2.83 42.83,5.42 | v31.8,1.57 32.65,1.57 34.4,3.33 34.4,4.38 34,4.78 31.95,4.78 31.32,5.4 v31.32,6.55
  Bottom 0.152: v40.7,10.3 40.9,10.5 40.9,13.2 40.58,13.53 v40.58,13.8 40.1,14.28 38.3,14.28 37.75,13.72 37.25,13.72 37.17,13.8 | v36.58,14.18 36.8,14.18 37.17,13.8 | v32.23,10.03 31.3,9.1 v31.3,8.88 31.32,8.8 v31.32,6.55 | v34.15,11.32 35.05,11.32 36.1,12.38 36.1,12.72 37.17,13.8 | v42.83,2.83 37.3,2.83 35.88,1.4 31.98,1.4 v31.8,1.57
I2C0_SDA  (via drill 0.33)
  Top 0.152: BARO1.6 38.35,14.1 41.35,11.1 R2.2 | BARO.6 42.15,12.47 42.15,12.05 41.33,11.22 R2.2 | 9-AXIS.4 42.35,6.47 v42.65,6.17 | v35.35,5.42 33.12,7.65 33.12,7.83 U1.16 | v41.38,8.72 41.35,8.75 41.35,10.97 R2.2
  Bottom 0.152: JP3.2 43.02,4.47 | 43.02,4.47 42.65,4.85 v42.65,6.17 42.62,6.25 41.38,7.5 v41.38,8.72 | v35.35,5.42 36.8,5.42 38.92,3.3 41.85,3.3 43.02,4.47
I2C1_SCL  (via drill 0.33)
  Top 0.152: U$4.6 16.4,12.72 16.3,12.62 14.05,12.62 R4.2 14.03,12.7 14.03,13.2 13.3,13.93 12.8,13.93 12.47,13.6 v12.47,10.47 | v29.25,9.45 33.1,9.45 35.45,11.8 35.5,11.8 35.75,12.05 36.27,12.05 36.6,11.72 36.6,11.22 36.05,10.68 35.95,10.68 U1.24
  Bottom 0.152: v29.25,9.45 29.18,9.45 24.68,4.95 21.73,4.95 20.5,6.17 20.5,9.93 19.95,10.47 v12.47,10.47
I2C1_SDA  (via drill 0.33)
  Top 0.152: U1.22 35.65,9.53 36.38,9.53 37.48,8.43 37.48,7.92 37.35,7.8 37.35,6.83 36.42,5.9 36.42,5.33 R1.2 36.35,5.3 36.3,5.3 35.85,4.85 35.1,4.85 34.6,5.35 v33.75,5.35 | v25.15,12.72 21.73,12.72 U$4.3
  Bottom 0.152: v25.15,12.72 25.98,12.72 28.1,10.6 32.48,10.6 33.05,10.03 33.05,7.05 32.8,6.8 32.8,6.3 v33.75,5.35
I2CB2B_SCL
  Top 0.152: JP6.4 18.75,13.22 16.98,11.45 16.52,11.45 U$4.7
I2CB2B_SDA
  Top 0.152: JP6.3 20.27,16.4 20.27,12.43 21.25,11.45 U$4.2
INT1_A/G
  Top 0.152: 9-AXIS.11 39.75,7.45 39.75,7.7 38.42,9.03 37.33,9.03 36.48,9.88 36.05,9.88 35.6,10.32 U1.23
LED_PIN
  Top 0.152: LED2.A 30.07,3.92 28.8,5.2 28.8,7.05 29.2,7.45 U1.10
N$1
  Top 0.152: R6.1 37.7,5.47 37.67,5.5 37.67,7.15 38,7.47 38.5,7.47 38.52,7.45 38.88,7.45 9-AXIS.13
N$2
  Top 0.152: U$5.P1 26.57,6.78 27.2,6.15 C3.1 27.73,6.22 27.73,8.1 U1.7
N$3  (via drill 0.33)
  Top 0.152: C1.1 24.7,5.45 24.75,5.5 U$5.P2 24.62,5.47 24.38,5.47 v23.65,6.2 | v26.65,7.75 27.77,8.88 U1.6
  Bottom 0.152: v26.65,7.75 25.2,7.75 v23.65,6.2
N$4  (via drill 0.33)
  Top 0.152: R5.1 35.77,1.43 v35.23,1.98
  Bottom 0.152: v35.23,1.98 33.42,1.98 U$7.3
N$5
  Top 0.152: LED2.C R9.2
N$6
  Bottom 0.152: D2.4 39.08,11.1 40.45,9.72 40.95,9.72 43.98,12.75 D1.2
N$11
  Top 0.152: 9-AXIS.21 40.17,4.15 40.4,3.92 40.48,3.92 C7.1
N$14
  Top 0.152: 9-AXIS.24 41.48,3.38 41.83,3.02 C20.1
N$15  (via drill 0.33)
  Top 0.152: v35.23,8.4 34.52,9.1 34.52,9.22 U1.20
  Bottom 0.152: v35.23,8.4 35.23,8.57 32.08,11.72 32.08,14.25 32.05,14.28 J1.D+
N$17  (via drill 0.33)
  Top 0.152: v36.02,11.47 35.58,11.47 33.75,9.65 33.75,9.45 34.15,9.05 U1.19 | v31.5,13.12 v32.65,11.97
  Bottom 0.152: v36.02,11.47 35.65,11.47 34.92,10.75 33.88,10.75 v32.65,11.97 | v31.5,13.12 31.5,14.1 31.4,14.2 J1.D-
N$20
  Top 0.406: S2.1 9.75,15.72 9.05,16.43 6.67,16.43 JP8.1
PIO0_1
  Top 0.152: JP2.1 25.55,8.05 27.07,9.57 U1.4
PIXEL  (via drill 0.33)
  Top 0.152: v34.17,12.93 34.17,13.15 34.85,13.82 U1.28
  Bottom 0.152: v34.17,12.93 34.17,12.15 34.55,11.78 35.05,11.78 35.77,12.5 35.77,12.88 36,13.1 36,14.43 38.25,16.68 D1.4
SSP1_MISO  (via drill 0.33)
  Top 0.152: v36.67,12.47 36.38,12.78 35.95,12.78 U1.25
  Bottom 0.152: v36.67,12.47 36.67,8.78 35.77,7.88 35.77,6.67 34.75,5.65 34.75,4.12 33.88,3.25 U$7.2
SSP1_MOSI  (via drill 0.33)
  Top 0.152: v32.48,8.75 32.88,8.75 33.42,8.2 33.45,8.2 U1.17
  Bottom 0.152: v32.48,8.75 32.48,5.33 29.57,2.42 29.57,1.62 28.68,0.72 28.2,0.72 U$7.5
SSP1_RST  (via drill 0.33)
  Top 0.152: v29.68,5.15 29.68,6.53 29.9,6.75 U1.12
  Bottom 0.152: v29.68,5.15 29.68,4.28 28.65,3.25 28.2,3.25 U$7.7
SSP1_SCK  (via drill 0.33)
  Top 0.152: v31.9,5.65 32.02,5.78 32.02,6.75 U1.13
  Bottom 0.152: v31.9,5.65 31.9,5.22 28.68,2 28.2,2 U$7.6
SSP1_SSEL  (via drill 0.33)
  Top 0.152: v34.33,7.28 34.33,7.85 33.83,8.35 33.83,8.53 U1.18
  Bottom 0.152: v34.33,7.28 34.33,5.1 33.75,4.53 U$7.1
USB_VBUS  (via drill 0.33)
  Top 0.152: v18,13.35 15.43,13.35 14.25,14.53 S2.3
  Bottom 0.152: J1.VBUS 30.75,13.72 29.98,12.95 26.2,12.95 25.95,13.2 25.5,13.2 25.35,13.35 v18,13.35
VBUS  (via drill 0.6)
  Top 0.152: U$6.1 11.53,10.97 12.15,11.6 12.15,12.25 11.53,12.88 U$6.3
  Top 0.406: 11.53,10.97 11.72,10.97 C18.1 | U$6.3 S2.2 11.97,15.55 v11.97,16.48
  pour Bottom: 12.05,17.8 24.02,17.8 24.02,15.72 14.57,15.88 12.97,14.28 10.65,14.12 10.53,14.25 10.53,17.45 10.93,17.85

### Text on the board
tPlace: teamRocket | This Side Up | thinManV2